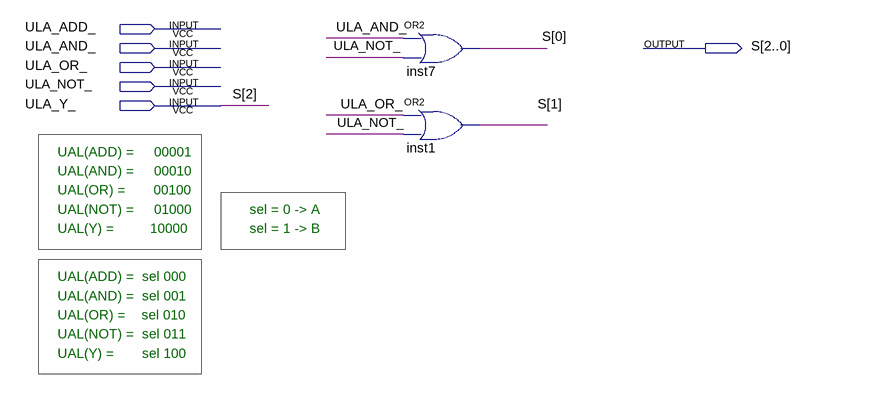
[diagram p0: schematic sheet]
// Quartus schematic CodificadorUla.bdf as structural Verilog: 2 symbols, 6 pins
module CodificadorUla (
  input  ULA_ADD_,
  input  ULA_AND_,
  input  ULA_OR_,
  input  ULA_NOT_,
  input  ULA_Y_,
  output [2:0] S
);

  or inst7 (S[0], ULA_AND_, ULA_NOT_);
  or inst1 (S[1], ULA_OR_, ULA_NOT_);

  assign S[2] = ULA_Y_;

  // Notes on the sheet:
  //   UAL(ADD) =     00001
  //   UAL(AND) =     00010
  //   UAL(OR) =       00100
  //   UAL(NOT) =     01000
  //   sel = 0 -> A
  //   UAL(Y) =         10000
  //   sel = 1 -> B
  //   UAL(ADD) =  sel 000
  //   UAL(AND) =  sel 001
  //   UAL(OR) =    sel 010
  //   UAL(NOT) =  sel 011
  //   UAL(Y) =       sel 100
endmodule
